# EAGLE schematic Adafruit FT232H Original (EAGLE 6.3)
COMPANY: ADAFRUIT INDUSTRIES; DRAWN: LADYADA; REV: A
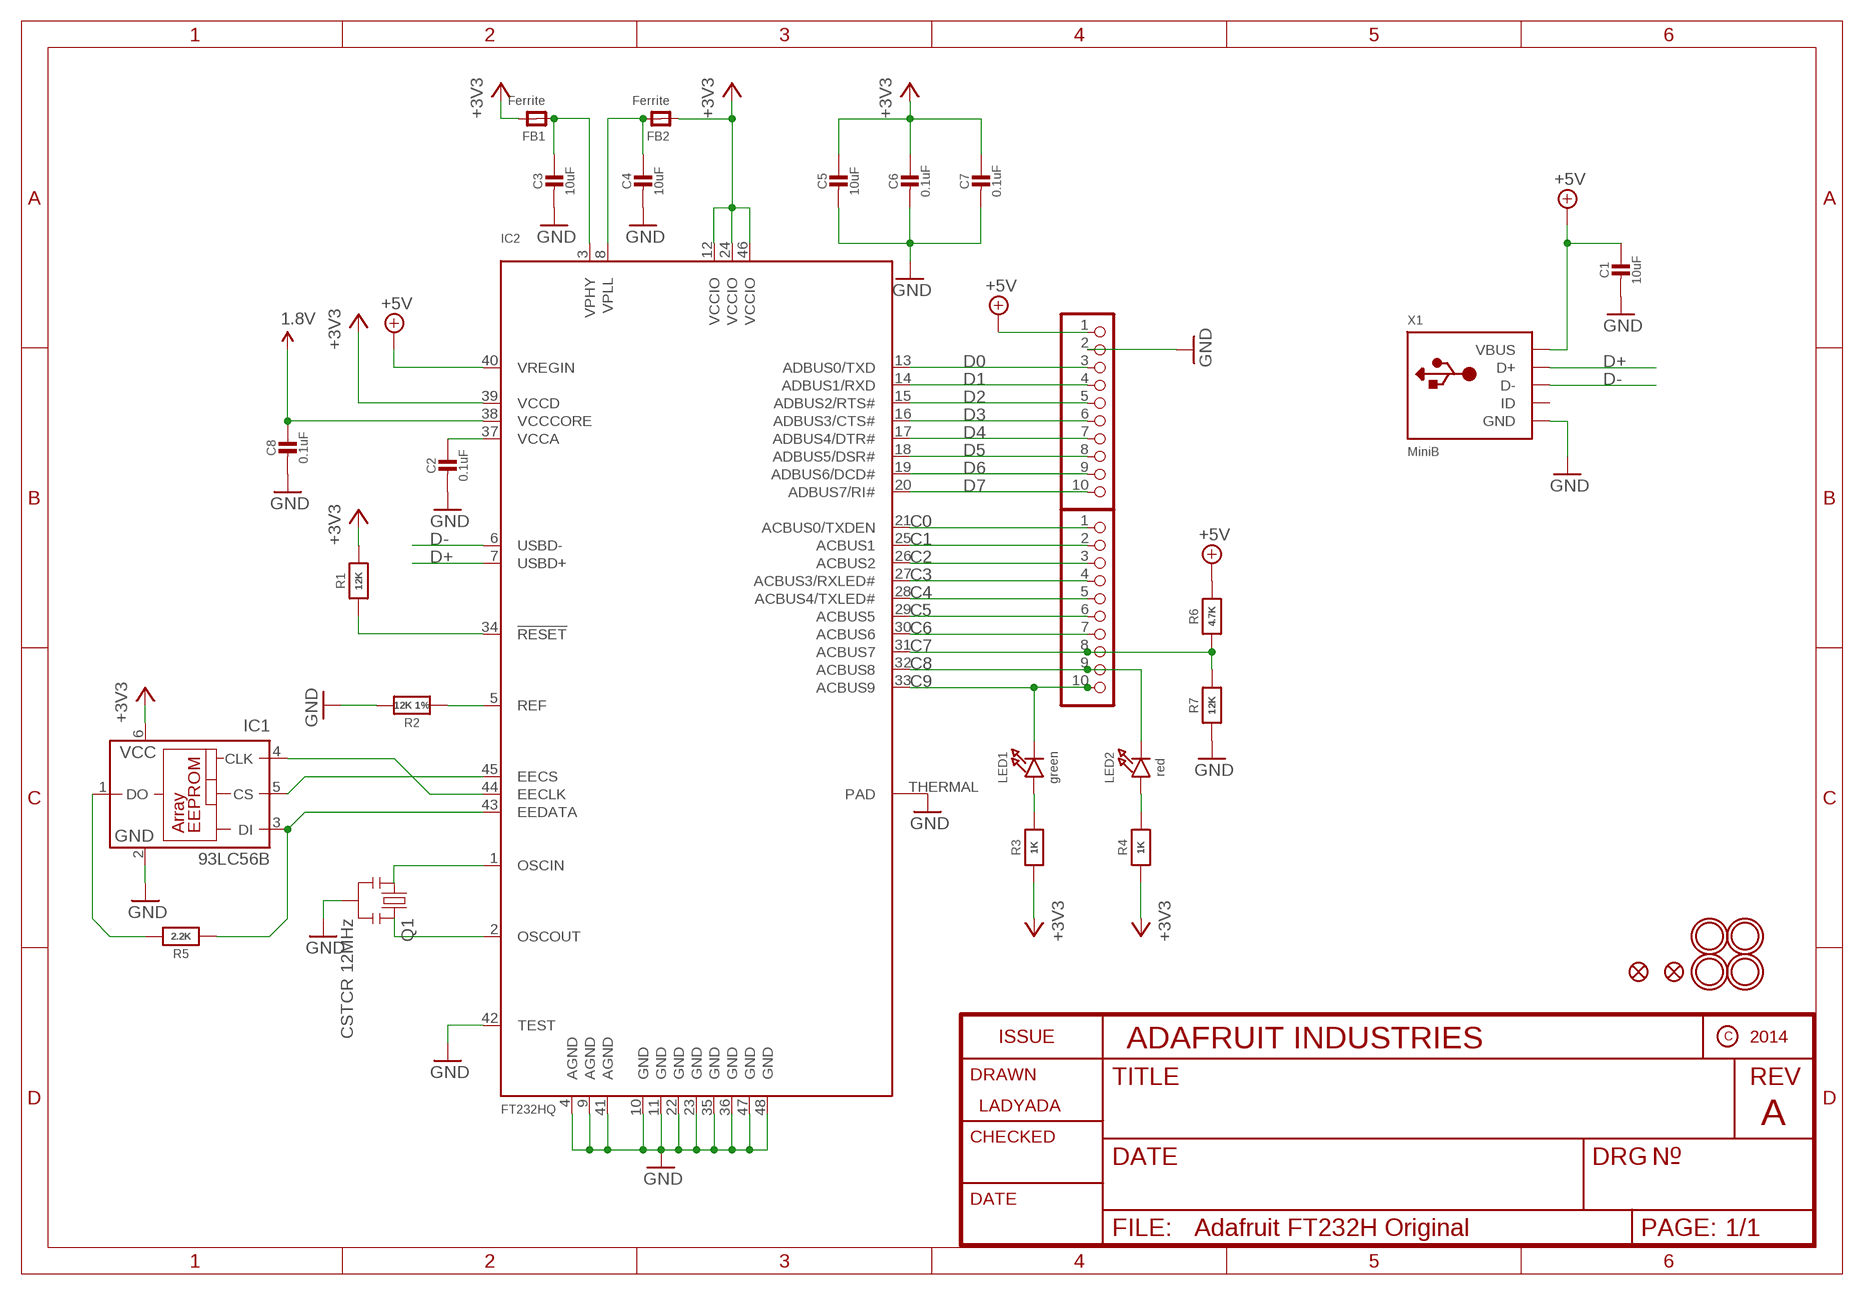
[diagram p0: schematic, sheet 1]

## Parts
C1  10uF  CAP_CERAMIC0805-NOOUTLINE  [0805-NO]
C2  0.1uF  CAP_CERAMIC0805-NOOUTLINE  [0805-NO]
C3  10uF  CAP_CERAMIC0805-NOOUTLINE  [0805-NO]
C4  10uF  CAP_CERAMIC0805-NOOUTLINE  [0805-NO]
C5  10uF  CAP_CERAMIC0805-NOOUTLINE  [0805-NO]
C6  0.1uF  CAP_CERAMIC0805-NOOUTLINE  [0805-NO]
C7  0.1uF  CAP_CERAMIC0805-NOOUTLINE  [0805-NO]
C8  0.1uF  CAP_CERAMIC0805-NOOUTLINE  [0805-NO]
FB1  Ferrite  FERRITE_0805  [_0805]
FB2  Ferrite  FERRITE_0805  [_0805]
FID1  FIDUCIAL""  [FIDUCIAL_1MM]
FID2  FIDUCIAL""  [FIDUCIAL_1MM]
IC1  93LC56B  93LC76A  [SOT23-6]
IC2  FT232HQ  [QFN48_8MM]
LED1  green  LED0805_NOOUTLINE  [CHIPLED_0805_NOOUTLINE]
LED2  red  LED0805_NOOUTLINE  [CHIPLED_0805_NOOUTLINE]
Q1  CSTCR 12MHz  RESONATORSMD  [RESONATOR-SMD]
R1  12K  RESISTOR0805_NOOUTLINE  [0805-NO]
R2  12K 1%  RESISTOR0805_NOOUTLINE  [0805-NO]
R3  1K  RESISTOR0805_NOOUTLINE  [0805-NO]
R4  1K  RESISTOR0805_NOOUTLINE  [0805-NO]
R5  2.2K  RESISTOR_0805MP  [_0805MP]
R6  4.7K  RESISTOR0805_NOOUTLINE  [0805-NO]
R7  12K  RESISTOR0805_NOOUTLINE  [0805-NO]
U$2  PINHD-1X10  [1X10-BIG]
U$3  PINHD-1X10  [1X10-BIG]
U$4  MOUNTINGHOLE2.5  [MOUNTINGHOLE_2.5_PLATED]
U$5  MOUNTINGHOLE2.5  [MOUNTINGHOLE_2.5_PLATED]
U$6  MOUNTINGHOLE2.5  [MOUNTINGHOLE_2.5_PLATED]
U$7  MOUNTINGHOLE2.5  [MOUNTINGHOLE_2.5_PLATED]
X1  MiniB  USBMICRO_20329  [4UCONN_20329]

## Nets
1.8V: C8.1 IC2.38(VCCCORE)
+3V3: C5.1 C6.1 C7.1 FB1.2 FB2.1 IC1.6(VCC) IC2.12(VCCIO) IC2.24(VCCIO) IC2.39(VCCD) IC2.46(VCCIO) R1.2 R3.1 R4.1
+5V: C1.1 IC2.40(VREGIN) R6.2 U$2.1 X1.VBUS
C0: IC2.21(ACBUS0/TXDEN) U$3.1
C1: IC2.25(ACBUS1) U$3.2
C2: IC2.26(ACBUS2) U$3.3
C3: IC2.27(ACBUS3/RXLED#) U$3.4
C4: IC2.28(ACBUS4/TXLED#) U$3.5
C5: IC2.29(ACBUS5) U$3.6
C6: IC2.30(ACBUS6) U$3.7
C7: IC2.31(ACBUS7) R6.1 R7.2 U$3.8
C8: IC2.32(ACBUS8) LED2.C U$3.9
C9: IC2.33(ACBUS9) LED1.C U$3.10
D0: IC2.13(ADBUS0/TXD) U$2.3
D1: IC2.14(ADBUS1/RXD) U$2.4
D2: IC2.15(ADBUS2/RTS#) U$2.5
D3: IC2.16(ADBUS3/CTS#) U$2.6
D4: IC2.17(ADBUS4/DTR#) U$2.7
D5: IC2.18(ADBUS5/DSR#) U$2.8
D6: IC2.19(ADBUS6/DCD#) U$2.9
D7: IC2.20(ADBUS7/RI#) U$2.10
D+: IC2.7(USBD+) X1.D+
D-: IC2.6(USBD-) X1.D-
GND: C1.2 C2.2 C3.2 C4.2 C5.2 C6.2 C7.2 C8.2 IC1.2(GND) IC2.4(AGND) IC2.9(AGND) IC2.10(GND) IC2.11(GND) IC2.22(GND) IC2.23(GND) IC2.35(GND) IC2.36(GND) IC2.41(AGND) IC2.42(TEST) IC2.47(GND) IC2.48(GND) IC2.THERMAL(PAD) Q1.2 R2.2 R7.1 U$2.2 X1.BASE@1(GND) X1.BASE@2(GND) X1.GND X1.SPRT@1(GND) X1.SPRT@2(GND) X1.SPRT@3(GND) X1.SPRT@4(GND)
N$2: IC2.1(OSCIN) Q1.1
N$3: IC2.2(OSCOUT) Q1.3
N$5: IC2.5(REF) R2.1
N$6: LED2.A R4.2
N$7: IC2.34(!RESET) R1.1
N$8: LED1.A R3.2
N$9: IC1.3(DI) IC2.43(EEDATA) R5.1
N$10: IC1.5(CS) IC2.45(EECS)
N$11: IC1.4(CLK) IC2.44(EECLK)
N$12: IC1.1(DO) R5.2
VCCA: C2.1 IC2.37(VCCA)
VPHY: C3.1 FB1.1 IC2.3(VPHY)
VPLL: C4.1 FB2.2 IC2.8(VPLL)
Unconnected: X1.ID

## Library data of the parts
C1-C8 = microbuilder:CAP_CERAMIC: Ceramic Capacitors For new designs, use the packages preceded by an '_' character since they are more reliable: The following footprints should be used on most boards: _0402 - Standard footprint for regular board layouts _0603 - Standard footprint for regular board layouts _0805 - Standard footprint for regular board layouts _1206 - Standard footprint for regular board layouts For extremely tight-pitch boards where space is at a premium, the following 'micro-pitch' footprints can be used (smaller pads, no silkscreen outline, etc.): _0402MP - Micro-pitch footprint for very dense/compact boards _0603MP - Micro-pitch footprint for very dense/compact boards _0805MP - Micro-pitch footprint for very dense/compact boards _1206MP - Micro-pitch footprint for very dense/compact boards
FB1 FB2 = microbuilder:FERRITE: Ferrite Bead 0603 MMZ1608B121C - 120 Ohm @ 100MHz, 600mA, 0.15 Ohm DC Resistance - Digikey: 445-2164-1-ND BK1608HW121-T - 120 Ohm, 600mA Ferrite Chip - Digikey: 587-1876-2-ND 0805 HZ0805B272R-10 - 2.7K Ohm @ 100MHz, 200mA, 0.8 Ohm DC Resistance - Digikey: 240-2504-1-ND (see also Murata BLM21BD272SN1L) MMZ2012Y152B - 1.5K Ohm @ 100MHz, 500mA, 0.4 Ohm DC Resistance - Digikey: 445-1560-1-ND - Mainly for high frequency (80-400MHz) MMZ2012R102A - 1K Ohm @ 100MHz, 500mA, 0.3 Ohm DC Resistance - Digikey: 445-1555-2-ND - More general purpose (10-200MHz)
FID1 FID2 = microbuilder:FIDUCIAL: Fiducial Alignment Points Various fiducial points for machine vision alignment.; BOM: EXCLUDE
IC1 = microchip:93*76?: 8K Microwire Compatible Serial EEPROM Source: http://ww1.microchip.com/downloads/en/DeviceDoc/21796H.pdf; MF: MICROCHIP; MPN: 93LC76AT-I/OT; OC_FARNELL: 1556170; OC_NEWARK: 61H6824
IC2 = microbuilder:FT232H
LED1 LED2 = microbuilder:LED: LED 0603 - 0603 Surface Mount Package 2mA: Green LED - Low Power (3.9mcd, 2ma, 1.7Vf) - Digikey: 475-2709-2-ND Orange LED - Low Power (9.8mcd, 2ma, 1.8Vf) - Digikey: 475-1194-2-ND Red LED - Low Power (5mcd, 2ma, 1.8Vf) - Digikey: 475-1195-2-ND Yellow LED - Low Power (7mcd, 2ma, 1.8Vf) - Digikey: 475-1196-2-ND 5mA: Blue LED - Low Power (17mcd, 5ma, 2.9Vf) - Digikey: LNJ937W8CRACT-ND 0805 - 0805 Surface Mount Package 2mA: Red LED (8.8mcd, 2mA, 1.8Vf, Clear) - Low Power [Digikey: 475-2510-1-ND] Green LED (5mcd, 2mA, 1.8Vf, Clear) - Low Power [Digikey: 475-2730-1-ND] Yellow LED (11.3mcd, 2mA, 1.8Vf, Clear) - Low Power [Digikey: 475-2555-1-ND] 20mA: Red LED (104mcd, 20mA, Diffused) - LS R976 [Digikey: 475-1278-6-ND] Red LED (12mcd, 20mA, 2.0Vf, Clear) - APT2012EC [Digikey: 754-1128-1-ND] Green LED (15mcd, 20mA, 2.2Vf, Clear) - APT2012GC [Digikey: 754-1131-1-ND] Orange LED (160mcd, 20mA, 2.1Vf, Clear) - APT2012SECK [Digikey: 754-1130-1-ND] 1206 - 1206 Surface Mount Package Green LED (26mcd, 20mA, Diffused) - LG N971 [Digikey: 475-1407-6-ND] Red LED (15mcd, 20mA, Diffused) - LH N974 [Digikey: 475-1416-6-ND] Cree - Cree High-Power Surface Mount LEDs XPEBWT-L1-0000-00D50 - White 111lm 350mA 2.9Vf 6200K 110° XTEAWT-00-0000-00000LEE3 - White 114lm 350mA 2.85Vf 5000K 115° Everlight - Everlight 45-21 Series Surface Mount LEDs 45-21/QK2C-B2832AC2CB2/2T - Warm White 2000mcd 20mA 3.25Vf 3050K 120° 45-21/LK2C-B38452C4CB2/2T - Nuetral White 2000mcd 20mA 3.25Vf 4150K 120° 45-21/LK2C-B50634C6CB2/2T - Cold White 2200mcd 20mA 3.25Vf 5650K 120° PLCC2 Reverse Mount LS T77K-J1L2-1-0-2-R18-Z - Red 11.25mcd 2mA 1.8Vf 630nm 120° LO T77K-L1M2-24-Z - Orange 19.6mcd 2mA 1.8Vf 606nm 120° LY T77K-K2M1-26-Z - Yellow 15.7mcd 2mA 1.8Vf 587nm 120°
Q1 = SparkFun:RESONATOR: Resonator Small SMD resonator. This is the itty bitty 10/20MHz resonators with built in caps. CSTCE10M0G55 and CSTCE20M0V53. Footprint has been reviewed closely but hasn't been tested yet.
R1-R7 = microbuilder:RESISTOR: Resistors For new designs, use the packages preceded by an '_' character since they are more reliable: The following footprints should be used on most boards: _0402 - Standard footprint for regular board layouts _0603 - Standard footprint for regular board layouts _0805 - Standard footprint for regular board layouts _1206 - Standard footprint for regular board layouts For extremely tight-pitch boards where space is at a premium, the following 'micro-pitch' footprints can be used (smaller pads, no silkscreen outline, etc.): _0402MP - Micro-pitch footprint for very dense/compact boards _0603MP - Micro-pitch footprint for very dense/compact boards _0805MP - Micro-pitch footprint for very dense/compact boards _1206MP - Micro-pitch footprint for very dense/compact boards
U$2 U$3 = adafruit2:PINHD-1X10: Pin header 1x10 0.1" spacing With round pins
U$4-U$7 = microbuilder:MOUNTINGHOLE: Mounting Hole For #2 screws (0.086"/2.18mm width, 0.094"/2.4mm hole) use 2.5mm; BOM: EXCLUDE
X1 = microbuilder:USB: USB Connectors USBMINIB - Surface Mount Female Mini-B USB Connector 4UConnector: 06564